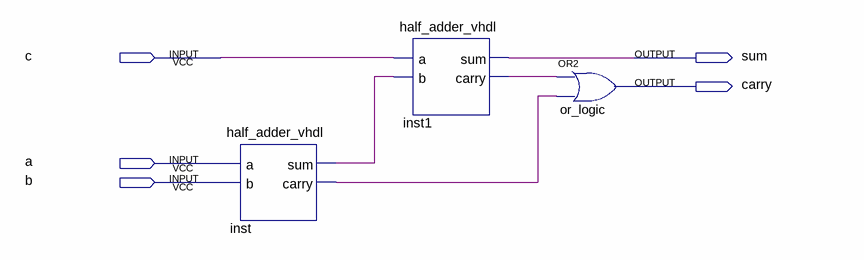
[diagram p0: schematic sheet]
// Quartus schematic full_adder_sch.bdf as structural Verilog: 3 symbols, 5 pins
module full_adder_sch (
  input  c,
  input  a,
  input  b,
  output sum,
  output carry
);

  wire inst1_carry, inst_carry, inst_sum;

  half_adder_vhdl inst (.a(a), .b(b), .sum(inst_sum), .carry(inst_carry));
  half_adder_vhdl inst1 (.a(c), .b(inst_sum), .sum(sum), .carry(inst1_carry));
  or or_logic (carry, inst1_carry, inst_carry);
endmodule
